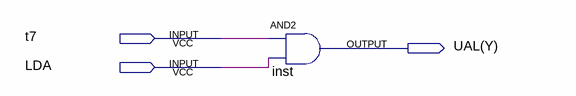
[diagram p0: schematic sheet]
// Quartus schematic UAL(Y).bdf as structural Verilog: 1 symbols, 3 pins
module \UAL(Y)  (
  input  t7,
  input  LDA,
  output \UAL(Y) 
);

  and inst (\UAL(Y) , t7, LDA);
endmodule
